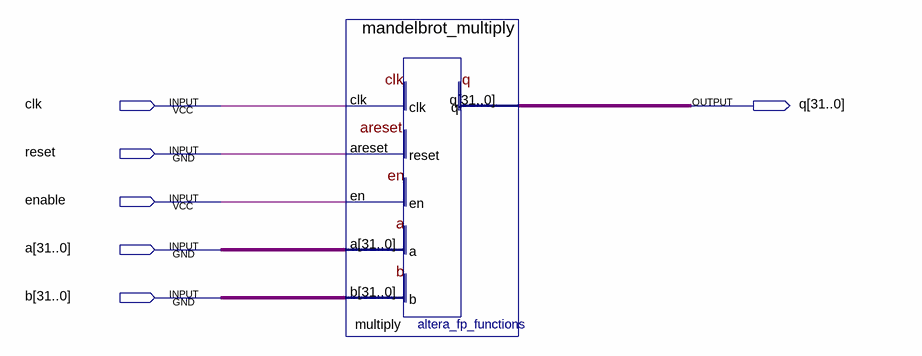
[diagram p0: schematic sheet]
// Quartus schematic multiply.bdf as structural Verilog: 1 symbols, 6 pins
module multiply (
  input  clk,
  input  reset,
  input  enable,
  input  [31:0] a,
  input  [31:0] b,
  output [31:0] q
);

  mandelbrot_multiply multiply (.clk(clk), .areset(reset), .en(enable), .a(a), .b(b), .q(q));
endmodule
